# Altium schematic sheet current_sense.SchDoc
size A4; SheetNumber: 3; SheetTotal: 3
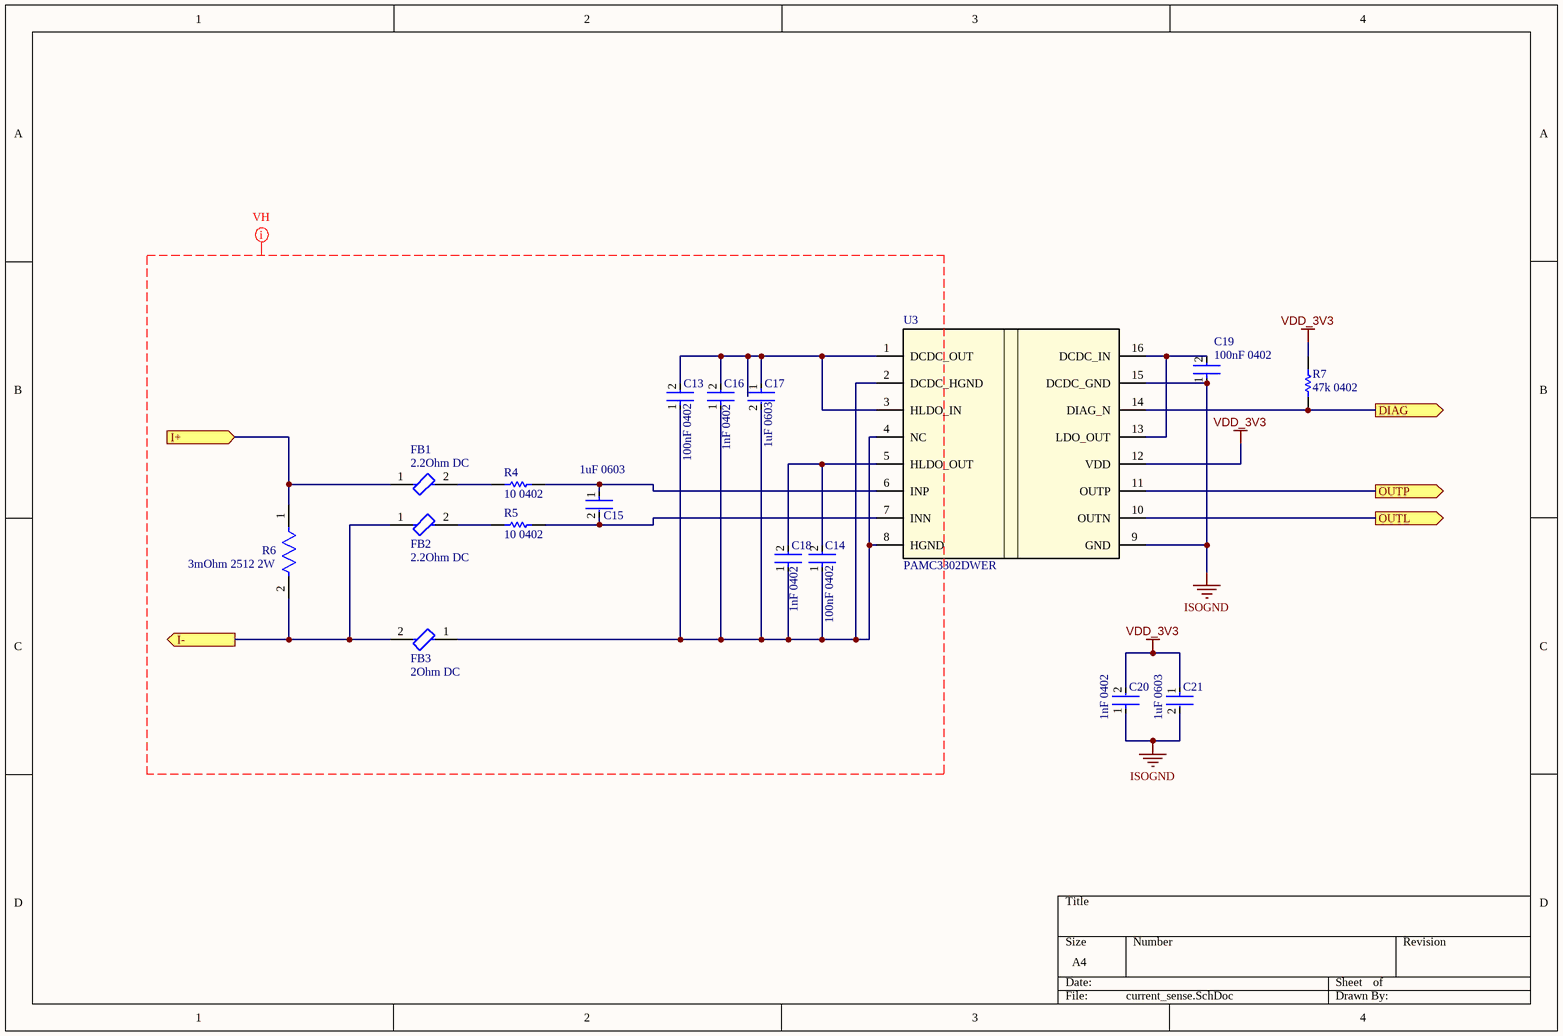
[diagram p0: current_sense.SchDoc]

## Parts
C13  100nF 0402  [CAP 0402_1005 RF]
C14  100nF 0402  [CAP 0402_1005 RF]
C15  1uF 0603  [CAP 0603_1608]
C16  1nF 0402  [CAP 0402_1005 RF]
C17  1uF 0603  [CAP 0603_1608]
C18  1nF 0402  [CAP 0402_1005 RF]
C19  100nF 0402  [CAP 0402_1005 RF]
C20  1nF 0402  [CAP 0402_1005 RF]
C21  1uF 0603  [CAP 0603_1608]
FB1  2.2Ohm DC  [FER 0402_1005]
FB2  2.2Ohm DC  [FER 0402_1005]
FB3  2Ohm DC  [FP-BKH1005-MFG]
R4  10 0402  [RES 0402_1005]
R5  10 0402  [RES 0402_1005]
R6  3mOhm 2512 2W  [FP-CSNL2512-MFG]
R7  47k 0402  [RES 0402_1005]
U3  PAMC3302DWER  [DWE0016A-IPC_A]

## Ports
DIAG (out), I+ (in), I- (out), OUTL (out), OUTP (out)

## Nets
ISOGND: C19.1 C20.1 C21.2 U3.9(GND) U3.15(DCDC_GND)
VDD_3V3: C20.2 C21.1 R7.1 U3.12(VDD)
DIAG: R7.2 U3.14(DIAG_N) ; port DIAG
I+: FB1.1 R6.1 ; port I+
I-: FB2.1 FB3.2 R6.2 ; port I-
OUTL: U3.10(OUTN) ; port OUTL
OUTP: U3.11(OUTP) ; port OUTP
NetC13_1: C13.1 C14.1 C16.1 C17.2 C18.1 FB3.1 U3.2(DCDC_HGND) U3.4(NC) U3.8(HGND)
NetC13_2: C13.2 C16.2 C17.1 U3.1(DCDC_OUT) U3.3(HLDO_IN)
NetC14_2: C14.2 C18.2 U3.5(HLDO_OUT)
NetC15_1: C15.1 R4.1 U3.6(INP)
NetC15_2: C15.2 R5.1 U3.7(INN)
NetC19_2: C19.2 U3.13(LDO_OUT) U3.16(DCDC_IN)
NetFB1_2: FB1.2 R4.2
NetFB2_2: FB2.2 R5.2

## Layout directives
net class VH: (no net found under the mark)

## Library data of the parts
C13 C14 C19 = b4654b650e69147ec39a6b967a45e02: MLCC 0402 100nF; Voltage: 50V; Tolerance: 5%; Dielectric: C0G; Insulation Resistance: 1GR; Dissipation Factor: 2.5%; Temperature Coefficient: 30ppm/°C; REACH SVHC: No SVHC; Termination: SMD/SMT; Construction: Flat; Contact Plating: Tin; Width: 0.02inch; Series: -; Voltage Rating (DC): 50V; Voltage Rating: 50V; Height: 0.56mm; Max Operating Temperature: 125°C; Length: 1mm; Lead Free: Lead Free; Case/Package: 0402; Min Operating Temperature: -55°C; Depth: 0.5mm; Case Code (Metric): 1005; Thickness: 0.022inch; Radiation Hardening: No; Case Code (Imperial): 0402; Mount: Surface Mount; Capacitance: 100nF; Packaging: Tape and Reel; Package Quantity: 1; RoHS Compliant: Yes; Supplier 1: Future Electronics; Supplier Part Number 1: 5964861
C15 = b4654b650e69147ec39a6b967a45e02: MLCC 0402 100pF; Voltage: 50V; Tolerance: 5%; Dielectric: C0G; Insulation Resistance: 1GR; Dissipation Factor: 2.5%; Temperature Coefficient: 30ppm/°C; REACH SVHC: No SVHC; Termination: SMD/SMT; Construction: Flat; Contact Plating: Tin; Width: 0.02inch; Series: -; Voltage Rating (DC): 50V; Voltage Rating: 50V; Height: 0.56mm; Max Operating Temperature: 125°C; Length: 1mm; Lead Free: Lead Free; Case/Package: 0402; Min Operating Temperature: -55°C; Depth: 0.5mm; Case Code (Metric): 1005; Thickness: 0.022inch; Radiation Hardening: No; Case Code (Imperial): 0402; Mount: Surface Mount; Capacitance: 1uF; Packaging: Tape and Reel; Package Quantity: 1; RoHS Compliant: Yes; Supplier 1: Future Electronics; Supplier Part Number 1: 9043971
C16 C18 C20 = b4654b650e69147ec39a6b967a45e02: MLCC 0402 1nF; Voltage: 50V; Tolerance: 5%; Dielectric: C0G; Insulation Resistance: 1GR; Dissipation Factor: 2.5%; Temperature Coefficient: 30ppm/°C; REACH SVHC: No SVHC; Termination: SMD/SMT; Construction: Flat; Contact Plating: Tin; Width: 0.02inch; Series: -; Voltage Rating (DC): 50V; Voltage Rating: 50V; Height: 0.56mm; Max Operating Temperature: 125°C; Length: 1mm; Lead Free: Lead Free; Case/Package: 0402; Min Operating Temperature: -55°C; Depth: 0.5mm; Case Code (Metric): 1005; Thickness: 0.022inch; Radiation Hardening: No; Case Code (Imperial): 0402; Mount: Surface Mount; Capacitance: 1nF; Packaging: Tape and Reel; Package Quantity: 1; RoHS Compliant: Yes; Supplier 1: Future Electronics; Supplier Part Number 1: 7077183
C17 C21 = b4654b650e69147ec39a6b967a45e02: MLCC 0603 1uF; Voltage: 50V; Tolerance: 5%; Dielectric: C0G; Insulation Resistance: 1GR; Dissipation Factor: 2.5%; Temperature Coefficient: 30ppm/°C; REACH SVHC: No SVHC; Termination: SMD/SMT; Construction: Flat; Contact Plating: Tin; Width: 0.02inch; Series: -; Voltage Rating (DC): 50V; Voltage Rating: 50V; Height: 0.56mm; Max Operating Temperature: 125°C; Length: 1mm; Lead Free: Lead Free; Case/Package: 0402; Min Operating Temperature: -55°C; Depth: 0.5mm; Case Code (Metric): 1005; Thickness: 0.022inch; Radiation Hardening: No; Case Code (Imperial): 0402; Mount: Surface Mount; Capacitance: 1uF; Packaging: Tape and Reel; Package Quantity: 1; RoHS Compliant: Yes; Supplier 1: Mouser; Supplier Part Number 1: 80-C0603C105K3R
FB1 FB2 = 5f30dd21d616792df468990f7003faa: Chip Ferrite Bead, 0402, 1800Ω @ 100MHz, 2.2Ω, 25%, 200mA; Impedance: 1.8kR; Number of Lines: 1; DC Resistance (DCR): 2.2R; Max Operating Temperature: 125°C; Packaging: Tape and Reel; Length: 0.039inch; Max Current Rating: 200mA; Mount: Surface Mount; Package Quantity: 10000; Ratings: AEC-Q200; Height: 0.022inch; Number of Circuits: 1; Case/Package: 0402; Min Operating Temperature: -55°C; Width: 0.02inch; RoHS Compliant: Yes; Supplier 1: Rs; Supplier Part Number 1: 332378
FB3 = CMP-14488-000017-2: 1.8 kOhms @ 100 MHz 1 Ferrite Bead 0402 (1005 Metric) 200mA 2Ohm; Number of Lines: 1; Impedance: 1.8kR; Tolerance: 25%; Test Frequency: 100MHz; DC Resistance (DCR): 2R; Case Code (Imperial): 0402; Mount: Surface Mount; Max Current Rating: 200mA; Max DC Current: 200mA; Length: 0.039inch; Case Code (Metric): 1005; Height: 0.022inch; Max Operating Temperature: 125°C; Packaging: Tape and Reel; Min Operating Temperature: -55°C; Package Quantity: 1; Lead Free: Lead Free; Series: BK; Depth: 0.55mm; Termination: SMD/SMT; Halogen Free: Halogen Free; RoHS Compliant: Yes; Width: 0.02inch; Case/Package: 0402
R4 R5 = Res1: Resistor 10Ohm 0603; Value: 10; Published: 8-Jun-2000; LatestRevisionDate: 17-Jul-2002; LatestRevisionNote: Re-released for DXP Platform.; PackageReference: AXIAL-0.3; Publisher: Altium Limited; PackageDescription: Axial Device, Thru-Hole; 2 Leads; 0.3 in Pin Spacing; Supplier 1: Future Electronics; Supplier Part Number 1: 2028518
R6 = CMP-26527-000012-1: RES 0.003 OHM 1% 2W 2512; 3DS Part Number: 110-00007; Manufacturer Part Number: CSNL2512FT3L00; Manufacturer: Stackpole; Value: 3mΩ; Temperature Coefficient: 50ppm/°C; Ipc Land Pattern Name: RESC635318X55; ComponentLink2Description: Datasheet; Octopart: https://octopart.com/csnl2512ft3l00-stackpole+electronics-19206420; ComponentLink2URL: https://www.seielect.com/Catalog/SEI-csnl.pdf; Device Class L2: Resistors; RoHS: TRUE; Temperature Range High: +170°C; Footprint Url: http://www.seielect.com/catalog/SEI-Std_Solder_Land_Patterns.pdf; Device Class L3: Chip SMD Resistors; Digikey Description: RES 0.003 OHM 1% 2W 2512; Temperature: -55°C to +170°C; Device Class L1: Passive Components; Lead Free: Yes; Category: Res; Series: CSNL; Resistance: 3mΩ; Temperature Range Low: -55°C; Composition: Metal Foil; Power Rating: 2W; Height: 0.75mm; Package: CSNL2512; Automotive: No; Tolerance: 1%
R7 = Res1: Resistor 47kOhm 0402; Published: 8-Jun-2000; LatestRevisionDate: 17-Jul-2002; LatestRevisionNote: Re-released for DXP Platform.; PackageReference: AXIAL-0.3; Publisher: Altium Limited; PackageDescription: Axial Device, Thru-Hole; 2 Leads; 0.3 in Pin Spacing; Value: 47k; Supplier 1: Mouser; Supplier Part Number 1: 71-CRCW0402-47K-E3
U3 = PAMC3302DWER: Â±50-mV input, precision reinforced isolated amplifier with integrated DC/DC converter 16-SOIC -40 to 125; Manufacturer_Name: Texas Instruments; TYPE: TYPE; RefDes: RefDes; Copyright: Copyright (C) 2025 Ultra Librarian. All rights reserved.; Manufacturer_Part_Number: PAMC3302DWER; Datasheet: https://www.ti.com/lit/gpn/amc3302